# EAGLE design Spy Circuits 3-transistor - Corr (EAGLE 7.2.0)
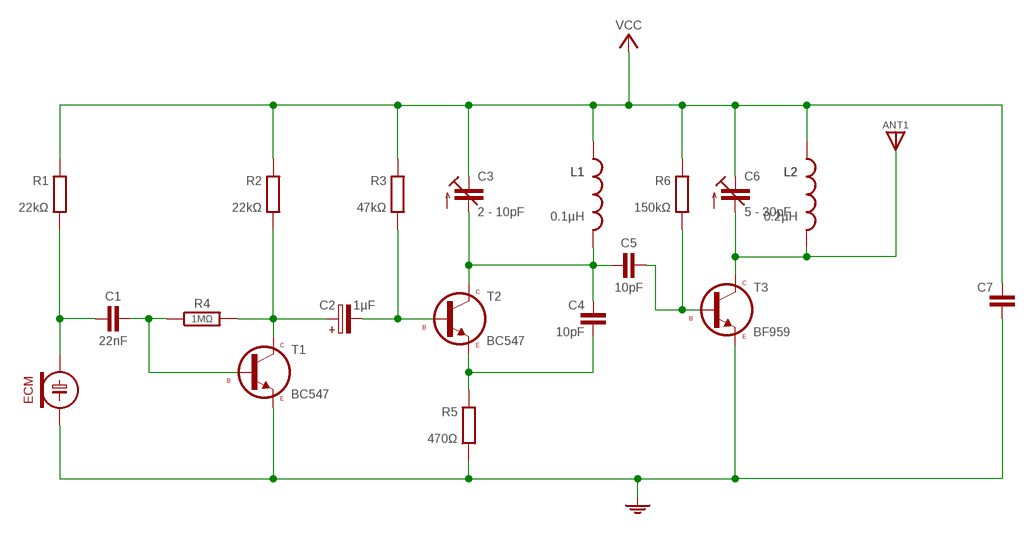
[diagram p0: schematic, sheet 1]

## Parts
ANT1  ANT  [SPAD]
C1  22nF  C-H025-015X024  [C025-015X024]
C2  1µF  CPOL-HE2,5-3  [E2,5-3]
C3  2 - 10pF  C-TR-PH201272222-808-45-2PIN  [TRIM-2222-808-45]
C4  10pF  C025-015X024/V  [C025-015X024/V]
C5  10pF  C-H025-015X024  [C025-015X024]
C6  5 - 30pF  C-TR-PH20127-C-BIG  [TRIM-C-BIG]
C7  C025-015X024/V  [C025-015X024/V]
ECM1  ECM-4  [ECM-4]
L1  0.1µH  L04/8V-2-M  [L-04/8V-2-M]
L2  0.2µH  L08-10/5  [L-08-10/5]
R1  22kΩ  R0204/2  [0204/2]
R2  22kΩ  R0204/10-V  [0204/10-V]
R3  47kΩ  R0204/10  [0204/10]
R4  1MΩ  R-H0202/2V  [0202/2V]
R5  470Ω  R0204/2  [0204/2]
R6  150kΩ  R0204/2  [0204/2]
S1  VCC_GNDL  [SPAD-+]
T1  BC547  [TO92]
T2  BC547  [TO92]
T3  BF959  [TO92-CEB]

## Nets
GND: C7.2 ECM1.2(-) R5.2 S1.1 T1.3(E) T3.E
N$1: C2.+ R2.2 R4.2 T1.1(C)
N$2: C1.2 R4.1 T1.2(B)
N$3: C1.1 ECM1.1(+) R1.2
N$4: C4.2 R5.1 T2.3(E)
N$5: C2.- R3.2 T2.2(B)
N$6: C3.2(A) C4.1 C5.1 L1.1 T2.1(C)
N$7: C5.2 R6.2 T3.B
N$8: ANT1.1 C6.P$1(A) L2.2 T3.C
VCC: C3.1(E) C6.P$3(E) C7.1 L1.2 L2.1 R1.1 R2.1 R3.1 R6.1 S1.2

## Library data of the parts
ANT1 = pad:ANT
C1 C5 = c:C-H
C2 = c:CPOL-H
C3 C6 = cap-trim:C-TR-PH20127
C4 C7 = c:C: CAPACITOR, European symbol
ECM1 = ECM:ECM
L1 L2 = l:L: Potentiometers Beckman, Copal, Piher, Spectrol, Schukat Created by librarian@cadsoft.de
R1-R3 R5 R6 = r:R: RESISTOR, European symbol
R4 = r:R-H
S1 = pad:VCC_GND
T1 T2 = t:BC547
T3 = t:BF959

## Board
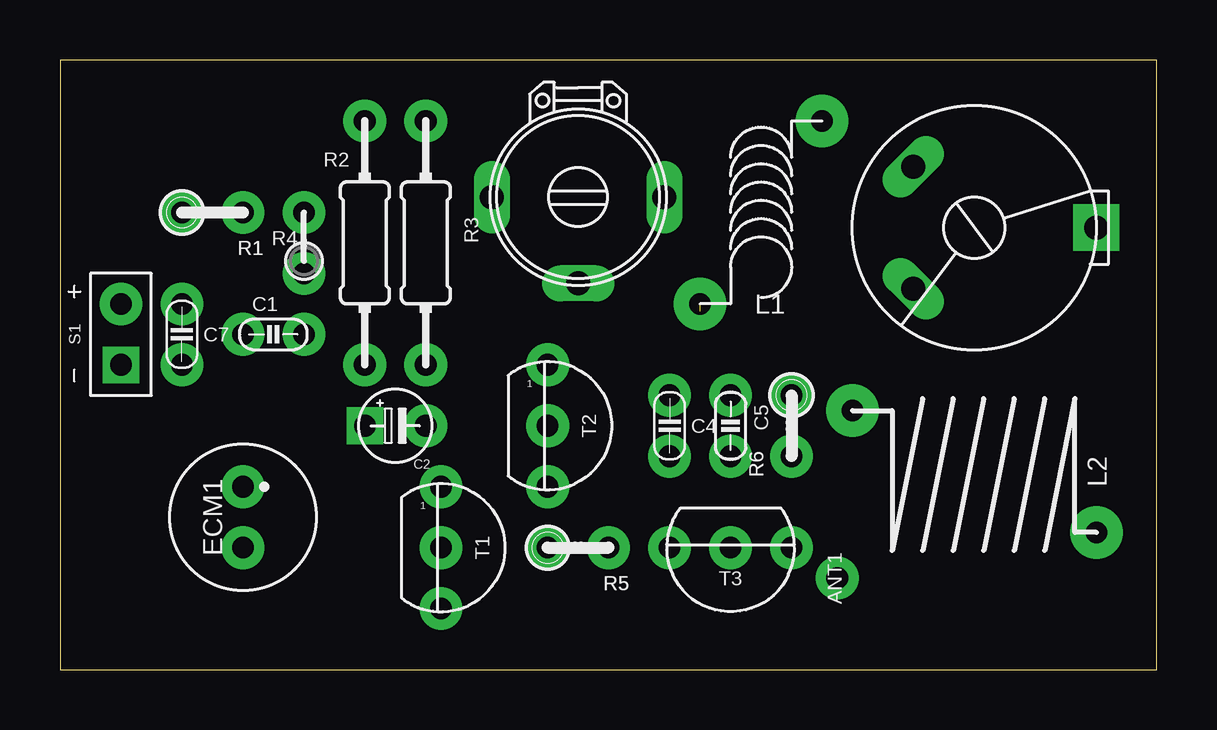
[diagram p1: board, top side]
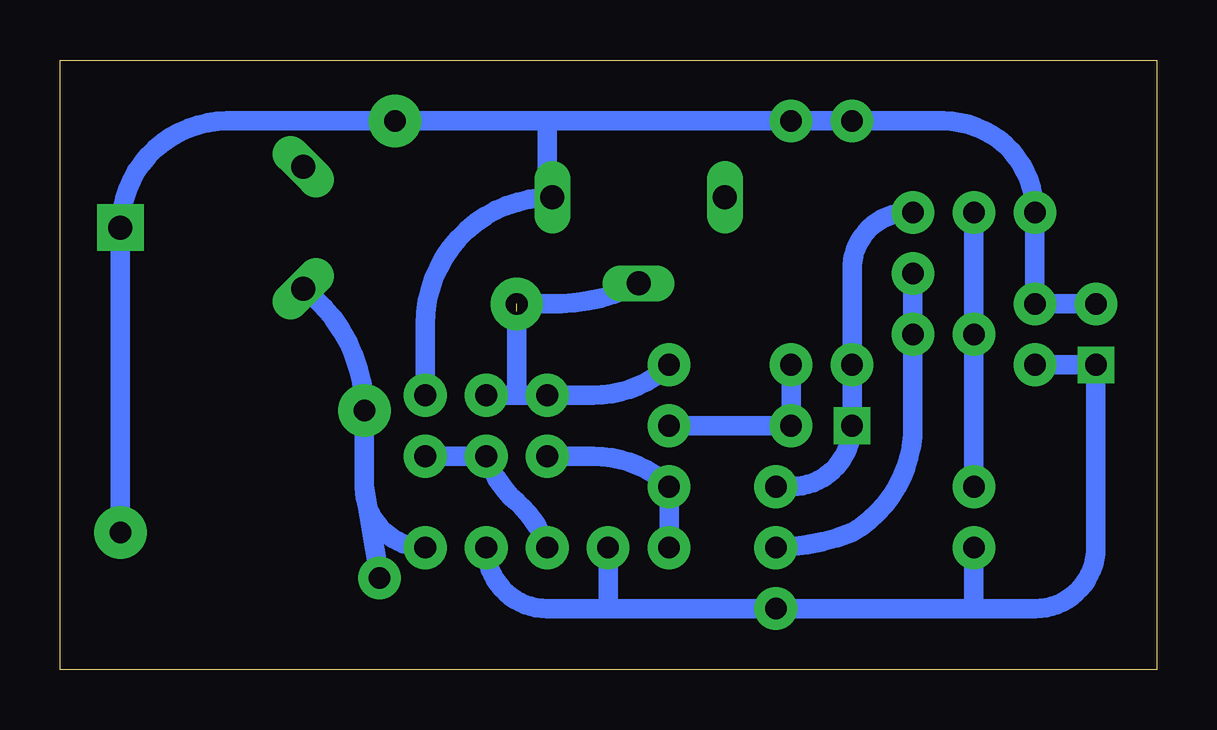
[diagram p2: board, bottom side, seen from below]

Size 45.7 x 25.4 mm. Coordinates in mm from the lower left corner, seen from the top.
Outline: 0,0 45.7,0 45.7,25.4 0,25.4 0,0
Copper layers (1*16): Top 0.035mm / dielectric 1.5mm / Bottom 0.035mm
Design rules "default": minimum track width 10mil, minimum drill 24mil, track to track 8mil, track to pad 8mil, pad to pad 8mil, via to via 8mil, smd to smd 8mil, copper to edge 40mil, drill to drill 8mil, minimum pad ring 10mil, minimum via ring 8mil, stop-mask expansion 4mil, vias tented up to drill 0mil, thermal gap 10mil

### Footprints (pad centres in the part's own frame; a part is rotated, then mirrored left to right if it is on the bottom)
SPAD = drill 0.9 pad 1.778: 1 0,0
C025-015X024 = drill 0.9 pad 1.778: 1 -1.27,0; 2 1.27,0
E2,5-3 = drill 0.9 pad 1.524 square: + -1.27,0 | drill 0.9 pad 1.778: - 1.27,0
TRIM-2222-808-45 = drill 1 long: 1 -3.592,0; 2 0,3.592; 3 3.592,0
C025-015X024/V = drill 0.9 pad 1.778: 1 0,-1.27; 2 0,1.27
TRIM-C-BIG = drill 1 long: P$1 2.54,2.54; P$2 2.54,-2.54 | drill 1 pad 1.93 square: P$3 -5.08,0
ECM-4 = drill 0.9 pad 1.778: 1 0,1.27; 2 0,-1.27
L-04/8V-2-M = drill 0.9 pad 2.184: 1 -2.54,-3.81; 2 2.54,3.81
L-08-10/5 = drill 0.9 pad 2.184: 1 2.54,5.08; 2 -2.54,-5.08
0204/2 = drill 0.9 pad 1.778: 1 1.27,0; 2 -1.27,0
0204/10-V = drill 0.9 pad 1.778: 1 0,5.08; 2 0,-5.08
0204/10 = drill 0.9 pad 1.778: 1 -5.08,0; 2 5.08,0
0202/2V = drill 0.9 pad 1.778: 1 0,-1.27; 2 0,1.27
SPAD-+ = drill 0.9 pad 1.524 square: 1 0,-1.27 | drill 0.9 pad 1.778: 2 0,1.27
TO92 = drill 0.9 pad 1.778: 1 0,2.54; 2 0,0; 3 0,-2.54
TO92-CEB = drill 0.9 pad 1.778: B 0,-2.54; C 0,2.54; E 0,0

### Placement (x,y rotation side)
ANT1  32.38,3.81 0 top
C1  8.89,13.97 0 top
C2  13.97,10.16 0 top
C3  21.59,19.68 180 top
C4  25.4,10.16 180 top
C5  27.94,10.16 270 top
C6  38.1,18.41 180 top
C7  5.08,13.97 180 top
ECM1  7.62,6.35 0 top
L1  29.21,19.05 0 top
L2  38.1,8.26 270 top
R1  6.35,19.05 180 top
R2  12.7,17.78 0 top
R3  15.24,17.78 270 top
R4  10.16,17.78 0 top
R5  21.59,5.08 180 top
R6  30.48,10.16 90 top
S1  2.54,13.97 0 top
T1  15.88,5.08 0 top
T2  20.32,10.16 0 top
T3  27.94,5.08 270 top

### Tracks (layer width: path | path; a pad name or v marks a point on that pad's centre or on a via)
GND
  Bottom 0.813: 7.62,2.54 T1.3 22.86,2.54 | ECM1.2 7.62,2.54 | 7.62,2.54 5.08,2.54 arc-90 2.54,5.08 S1.1 C7.2 | T3.E arc-90 25.4,2.54 22.86,2.54 | R5.2 22.86,2.54
N$1
  Bottom 0.813: R4.2 arc-90 12.7,16.83 R2.2 C2.+ arc90 15.24,7.62 T1.1
N$2
  Bottom 0.813: R4.1 C1.2 10.16,10.16 arc60 12.7,5.71 arc20 T1.2
N$3
  Bottom 0.813: R1.2 C1.1 ECM1.1
N$4
  Bottom 0.813: C4.2 23.5,8.89 arc45 T2.3 R5.1
N$5
  Bottom 0.813: T2.2 C2.- R3.2
N$6  (1 unrouted)
  Bottom 0.813: T2.1 arc45 23.5,11.43 C4.1 26.67,11.43 | C3.2 arc30 25.4,15.24 L1.1 | 26.67,11.43 C5.1 arc180 27.94,11.75 | 26.67,14.92 26.67,11.43
N$7
  Bottom 0.813: R6.2 C5.2 arc-30 26.67,6.99 arc30 T3.B
N$8
  Bottom 0.813: T3.C arc90 33.02,7.62 | 33.02,7.62 L2.2 arc-53 C6.P$1 | ANT1.1 33.02,7.62
VCC
  Bottom 0.813: S1.2 C7.1 R1.1 arc-90 8.89,22.86 R2.1 R3.1 25.4,22.86 | 25.4,22.86 25.4,19.9 arc-90 C3.1 arc-90 30.48,14.39 R6.1 | 25.4,22.86 L1.2 38.73,22.86 arc-90 C6.P$3 L2.1